# EAGLE schematic rain sensor (EAGLE 6.5.0)
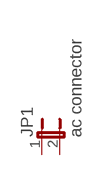
[diagram p0: schematic, sheet 1]

## Parts
JP1  ac connector  JP1E  [JP1]
Unconnected: JP1.1 JP1.2

## Library data of the parts
JP1 = jumper:JP1E: JUMPER